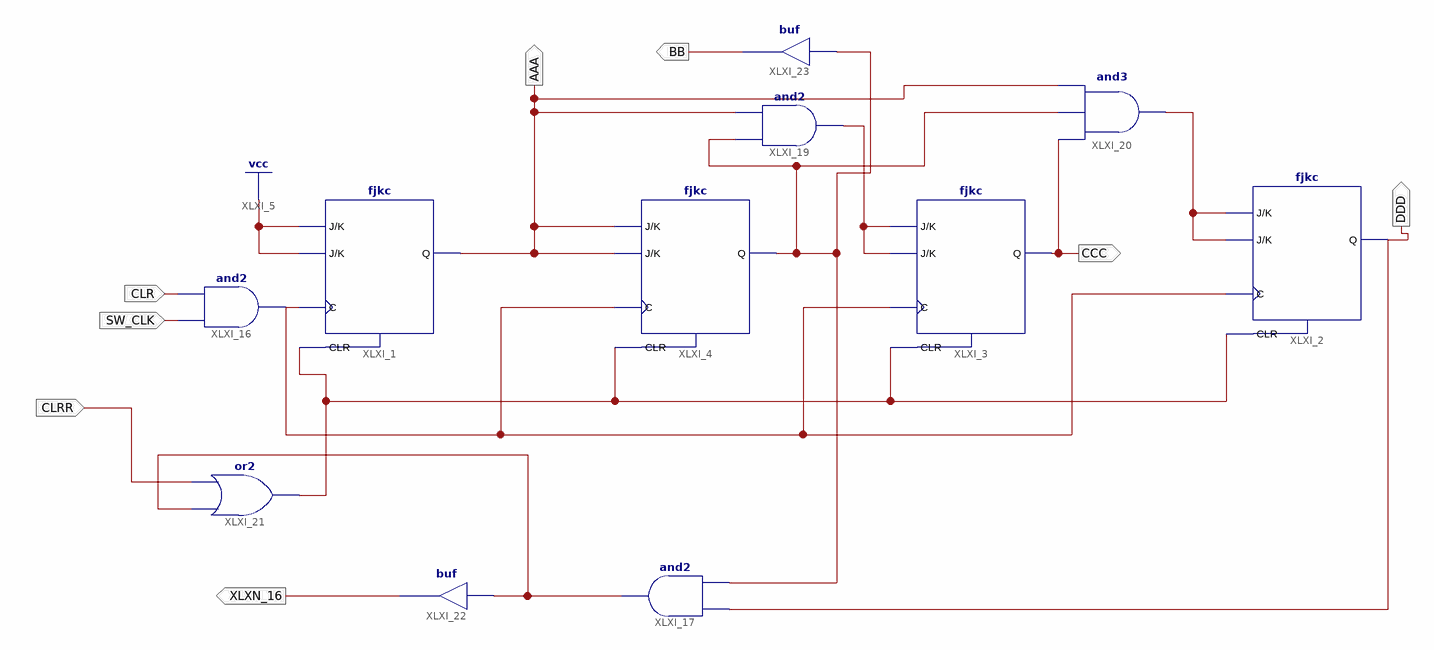
[diagram p0: schematic sheet 1]
// Xilinx ISE schematic COU00_99.sch (spartan6) as structural Verilog: 11 symbols, 8 ports
module COU00_99 (
  input  CLR,
  input  SW_CLK,
  input  CLRR,
  output AAA,
  output CCC,
  output XLXN_16,
  output BB,
  output DDD
);

  wire BBB, XLXN_1, XLXN_21, XLXN_49, XLXN_56, XLXN_63;

  fjkc XLXI_1 (.C(XLXN_1), .CLR(XLXN_56), .J(1'b1), .K(1'b1), .Q(AAA));
  fjkc XLXI_2 (.C(XLXN_1), .CLR(XLXN_56), .J(XLXN_49), .K(XLXN_49), .Q(DDD));
  fjkc XLXI_3 (.C(XLXN_1), .CLR(XLXN_56), .J(BBB), .K(BBB), .Q(CCC));
  fjkc XLXI_4 (.C(XLXN_1), .CLR(XLXN_56), .J(AAA), .K(AAA), .Q(XLXN_21));
  and XLXI_16 (XLXN_1, SW_CLK, CLR);
  and XLXI_17 (XLXN_63, XLXN_21, DDD);
  and XLXI_19 (BBB, XLXN_21, AAA);
  and XLXI_20 (XLXN_49, CCC, XLXN_21, AAA);
  or XLXI_21 (XLXN_56, XLXN_63, CLRR);
  buf XLXI_22 (XLXN_16, XLXN_63);
  buf XLXI_23 (BB, XLXN_21);
endmodule
